# Altium schematic sheet Main.SchDoc
size A4; SheetNumber: 1; SheetTotal: 5
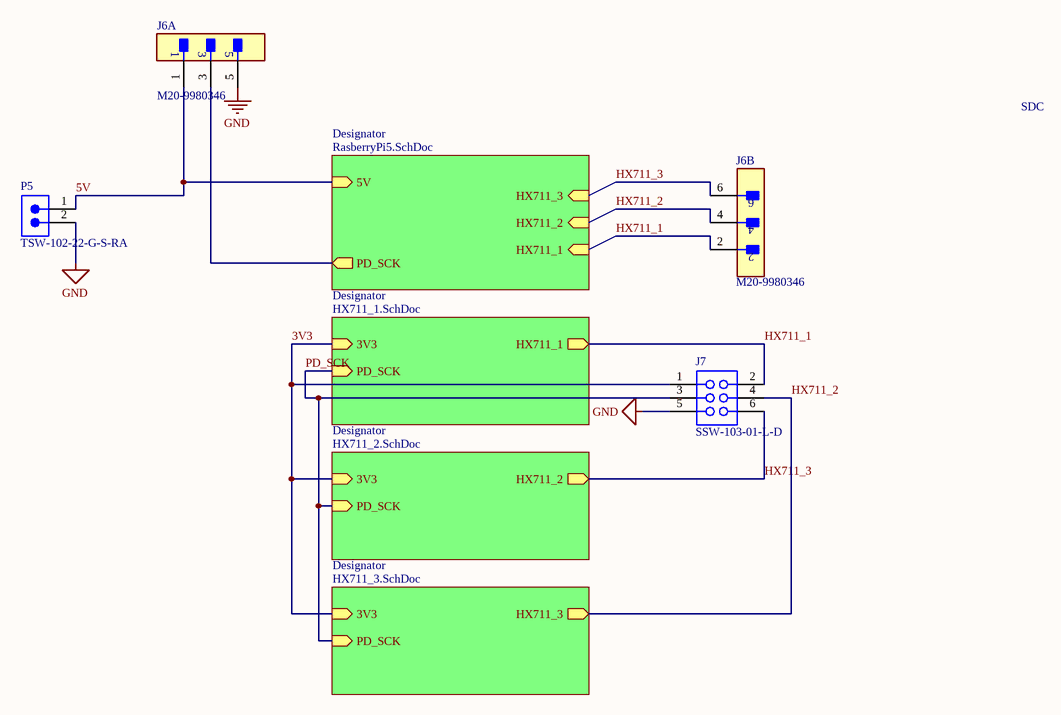
[diagram p0: Main.SchDoc]

## Parts
J6  M20-9980346  [FP-M20-9980346-MFG]  (parts A,B of 2)
J7  SSW-103-01-L-D  [SMTC-SSW-103-01-X-D]
P5  TSW-102-22-G-S-RA  [SMTC-TSW-102-22-X-S-RA]

## Sub-sheets
Designator = RasberryPi5.SchDoc: 5V (in), HX711_1 (in), HX711_2 (in), HX711_3 (in), PD_SCK (out)
Designator = HX711_1.SchDoc: 3V3 (in), HX711_1 (out), PD_SCK (in)
Designator = HX711_2.SchDoc: 3V3 (in), HX711_2 (out), PD_SCK (in)
Designator = HX711_3.SchDoc: 3V3 (in), HX711_3 (out), PD_SCK (in)

## Nets
GND: J6.5 J7.5 P5.2
3V3: J7.1 ; sheet Designator/3V3, sheet Designator/3V3, sheet Designator/3V3
5V: J6.1 P5.1 ; sheet Designator/5V
HX711_1: J6.2 J7.2 ; sheet Designator/HX711_1, sheet Designator/HX711_1
HX711_2: J6.4 J7.4 ; sheet Designator/HX711_2, sheet Designator/HX711_3
HX711_3: J6.6 J7.6 ; sheet Designator/HX711_3, sheet Designator/HX711_2
PD_SCK: J7.3 ; sheet Designator/PD_SCK, sheet Designator/PD_SCK, sheet Designator/PD_SCK
NetJ6_3: J6.3 ; sheet Designator/PD_SCK

## Notes on the sheet
- SDC

## Library data of the parts
J6 = CMP-2000-06636-2: CONN HEADER VERT 6POS 2.54MM; Manufacturer: Harwin; Current Rating: 3A; Number Of Contacts: 6; Conn Gender: Male; Conn Orientation: Vertical; Device Class L1: Connectors; ComponentLink2Description: Datasheet; Height: 8.99mm; Temperature Range High: +105°C; Contact Material: Tin,Nickel; RoHS: TRUE; Temperature Range Low: -40°C; ComponentLink2URL: https://cdn.harwin.com/pdfs/M20-998.pdf; Digikey Description: CONN HEADER VERT 6POS 2.54MM; Pitch: 2.54mm; Package: M20-9980346; Device Class L2: Headers and Wire Housings; Manufacturer Part Number: M20-9980346; Number Of Rows: 2; Category: Conn; Lead Free: Yes; Mouser Description: 2.54mm (0.1") Pitch DIL Vertical PC Tail Pin Header, 6.1mm mating pin height, tin, 3+3 contacts; Temperature: -40°C to +105°C; Device Class L3: unset; Octopart: https://octopart.com/m20-9980346-harwin-5436545; Automotive: No
J7 = CMP-1023-00330-1: SQ Post Socket, Through-hole, Vertical, -55 to 125 degC, 2.54 mm Pitch, 6-Pin, Female, RoHS; Manufacturer: Samtec; Pitch: 2.54 mm; ComponentLink3Description: Package Specification; DatasheetVersion: F-214; Mounting Technology: Through-hole; RoHS: True; PackageDescription: Assembly, Socket Strip .016 X .031 Tail; Temperature Range: -55 to 125 degC; ComponentLink1Description: Manufacturer URL; ComponentLink2Description: Datasheet; ComponentLink3URL: http://www.samtec.com/documents/webfiles/cpdf/SSW-1XX-XX-XXX-X-XX-XXX-XX-MKT.pdf; ComponentLink2URL: http://www.samtec.com/documents/webfiles/pdf/SSW_TH.PDF; Orientation: Vertical; PartNumber: SSW-103-01-L-D; PackageReference: SSW-103-01-X-D; PackageVersion: CA, 6/1987; ComponentLink1URL: http://www.samtec.com
P5 = CMP-1024-00323-1: 0.025" SQ Post Header, Through-hole, Right Angle, -55 to 125 degC, 2.54 mm Pitch, 2-Pin, Male, RoHS; Manufacturer: Samtec; Pitch: 2.54 mm; ComponentLink2URL: http://www.samtec.com/documents/webfiles/pdf/TSW_TH.PDF; PackageVersion: DM, 8/1988; PartNumber: TSW-102-22-G-S-RA; ComponentLink1URL: http://www.samtec.com; ComponentLink3URL: http://www.samtec.com/documents/webfiles/cpdf/TSW-XXX-XX-XXX-X-XX-XXX-MKT.pdf; Mounting Technology: Through-hole; DatasheetVersion: F-214; Temperature Range: -55 to 125 degC; PackageDescription: .025[0.64] SQ. Post Terminal Strip Assembly; ComponentLink2Description: Datasheet; ComponentLink3Description: Package Specification; PackageReference: TSW-102-22-X-S-RA; ComponentLink1Description: Manufacturer URL; RoHS: True; Orientation: Right Angle